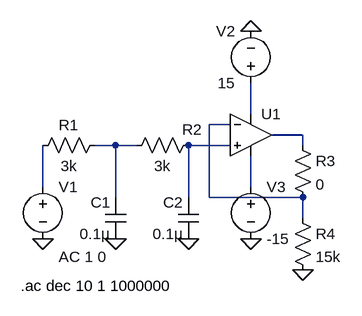
[diagram p0: schematic Lab7LP.asc]
Lab7LP.asc, the LTspice schematic file:
Version 4
SHEET 1 880 680
WIRE 320 64 320 16
WIRE 288 80 256 80
WIRE 400 96 352 96
WIRE 112 112 80 112
WIRE 144 112 112 112
WIRE 288 112 224 112
WIRE 400 112 400 96
WIRE 0 176 0 112
WIRE 320 176 320 128
WIRE 112 192 112 112
WIRE 224 192 224 112
WIRE 256 192 256 80
WIRE 400 192 256 192
WIRE 400 224 400 192
FLAG 0 256 0
FLAG 224 256 0
FLAG 320 256 0
FLAG 400 304 0
FLAG 320 -64 0
FLAG 112 256 0
SYMBOL res 96 96 R90
WINDOW 0 0 56 VBottom 2
WINDOW 3 32 56 VTop 2
SYMATTR InstName R1
SYMATTR Value 3k
SYMBOL res 240 96 R90
WINDOW 0 7 10 VBottom 2
WINDOW 3 32 56 VTop 2
SYMATTR InstName R2
SYMATTR Value 3k
SYMBOL cap 128 256 R180
WINDOW 0 24 56 Left 2
WINDOW 3 24 8 Left 2
SYMATTR InstName C1
SYMATTR Value 0.1µ
SYMBOL cap 240 256 R180
WINDOW 0 24 56 Left 2
WINDOW 3 24 8 Left 2
SYMATTR InstName C2
SYMATTR Value 0.1µ
SYMBOL res 384 96 R0
SYMATTR InstName R3
SYMATTR Value 0
SYMBOL res 384 208 R0
SYMATTR InstName R4
SYMATTR Value 15k
SYMBOL OpAmps\\UniversalOpAmp 320 96 R0
SYMATTR InstName U1
SYMBOL voltage 0 160 R0
WINDOW 123 24 124 Left 2
WINDOW 39 0 0 Left 0
SYMATTR InstName V1
SYMATTR Value ""
SYMATTR Value2 AC 1 0
SYMBOL voltage 320 32 R180
WINDOW 0 24 96 Left 2
WINDOW 3 24 16 Left 2
WINDOW 123 0 0 Left 0
WINDOW 39 0 0 Left 0
SYMATTR InstName V2
SYMATTR Value 15
SYMBOL voltage 320 160 R0
WINDOW 123 0 0 Left 0
WINDOW 39 0 0 Left 0
SYMATTR InstName V3
SYMATTR Value -15
TEXT -34 328 Left 2 !.ac dec 10 1 1000000

The netlist it stands for:
* Lab7LP.asc
R1 N004 N006 3k
R2 N005 N004 3k
C1 0 N004 0.1µ
C2 0 N005 0.1µ
R3 N003 N002 0
R4 N002 0 15k
XU1 N005 N002 N001 N007 N003 level1 Avol=1Meg GBW=10Meg Vos=0 En=0 Enk=0 In=0 Ink=0 Rin=500Meg  ; pins In+ In- V+ V- OUT
V1 N006 0 AC 1 0
V2 N001 0 15
V3 N007 0 -15
.ac dec 10 1 1000000
.lib UniversalOpAmp1.lib
.backanno
.end